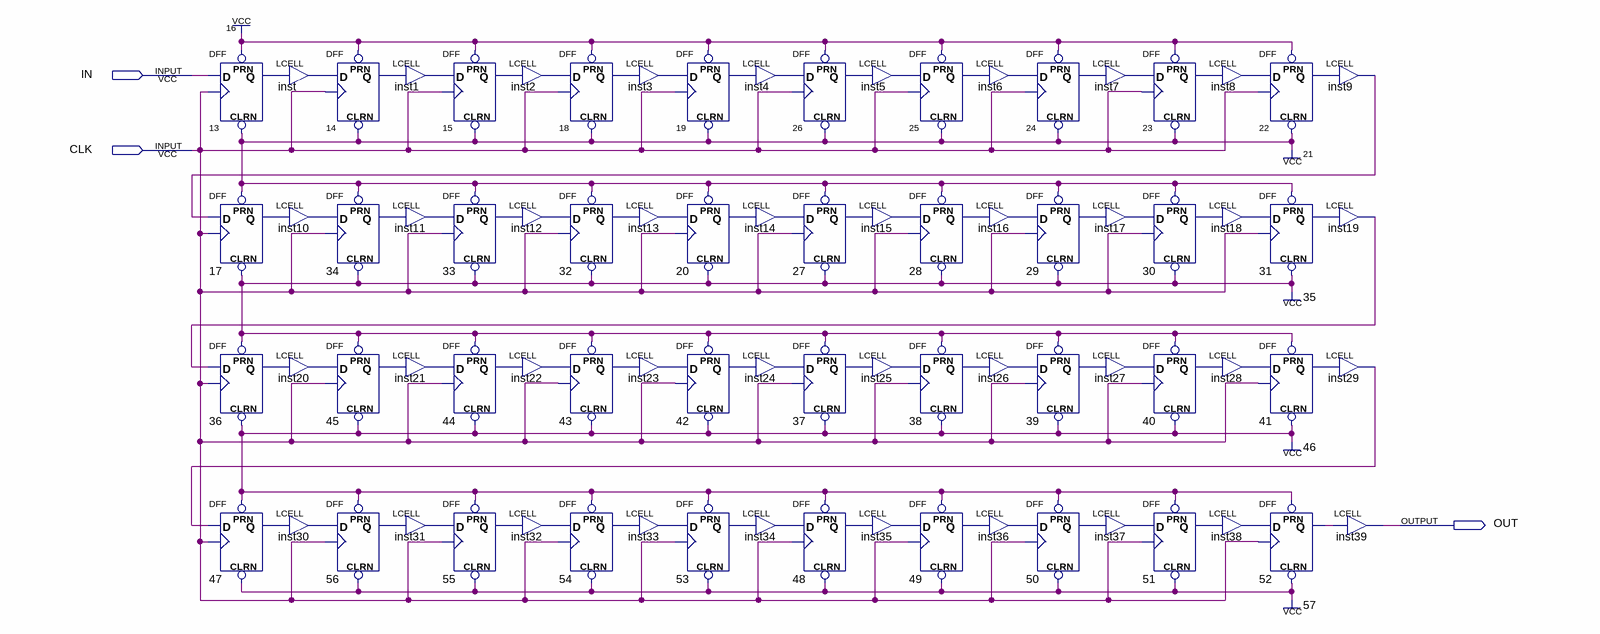
[diagram p0: schematic sheet]
// Quartus schematic sr40.bdf as structural Verilog: 80 symbols, 3 pins
module sr40 (
  input  IN,
  input  CLK,
  output OUT
);

  wire inst1_out, inst2_out, inst3_out, inst4_out, inst5_out, inst6_out, inst7_out, inst8_out, inst9_out,
       inst10_out, inst11_out, inst12_out, inst13_out, inst14_out, inst15_out, inst16_out, inst17_out,
       inst18_out, inst19_out, inst20_out, inst21_out, inst22_out, inst23_out, inst24_out, inst25_out,
       inst26_out, inst27_out, inst28_out, inst29_out, inst30_out, inst31_out, inst32_out, inst33_out,
       inst34_out, inst35_out, inst36_out, inst37_out, inst38_out, inst_out, n13_q, n14_q, n15_q, n17_q,
       n18_q, n19_q, n20_q, n22_q, n23_q, n24_q, n25_q, n26_q, n27_q, n28_q, n29_q, n30_q, n31_q, n32_q,
       n33_q, n34_q, n36_q, n37_q, n38_q, n39_q, n40_q, n41_q, n42_q, n43_q, n44_q, n45_q, n47_q, n48_q,
       n49_q, n50_q, n51_q, n52_q, n53_q, n54_q, n55_q, n56_q;

  DFF u_13 (.CLRN(1'b1), .CLK(CLK), .D(IN), .PRN(1'b1), .Q(n13_q));
  DFF u_17 (.CLRN(1'b1), .CLK(CLK), .D(inst9_out), .PRN(1'b1), .Q(n17_q));
  DFF u_36 (.CLRN(1'b1), .CLK(CLK), .D(inst19_out), .PRN(1'b1), .Q(n36_q));
  DFF u_47 (.CLRN(1'b1), .CLK(CLK), .D(inst29_out), .PRN(1'b1), .Q(n47_q));
  LCELL inst (.IN(n13_q), .OUT(inst_out));
  LCELL inst10 (.IN(n17_q), .OUT(inst10_out));
  LCELL inst20 (.IN(n36_q), .OUT(inst20_out));
  LCELL inst30 (.IN(n47_q), .OUT(inst30_out));
  DFF u_14 (.CLRN(1'b1), .CLK(CLK), .D(inst_out), .PRN(1'b1), .Q(n14_q));
  DFF u_34 (.CLRN(1'b1), .CLK(CLK), .D(inst10_out), .PRN(1'b1), .Q(n34_q));
  DFF u_45 (.CLRN(1'b1), .CLK(CLK), .D(inst20_out), .PRN(1'b1), .Q(n45_q));
  DFF u_56 (.CLRN(1'b1), .CLK(CLK), .D(inst30_out), .PRN(1'b1), .Q(n56_q));
  LCELL inst1 (.IN(n14_q), .OUT(inst1_out));
  LCELL inst11 (.IN(n34_q), .OUT(inst11_out));
  LCELL inst21 (.IN(n45_q), .OUT(inst21_out));
  LCELL inst31 (.IN(n56_q), .OUT(inst31_out));
  DFF u_15 (.CLRN(1'b1), .CLK(CLK), .D(inst1_out), .PRN(1'b1), .Q(n15_q));
  DFF u_33 (.CLRN(1'b1), .CLK(CLK), .D(inst11_out), .PRN(1'b1), .Q(n33_q));
  DFF u_44 (.CLRN(1'b1), .CLK(CLK), .D(inst21_out), .PRN(1'b1), .Q(n44_q));
  DFF u_55 (.CLRN(1'b1), .CLK(CLK), .D(inst31_out), .PRN(1'b1), .Q(n55_q));
  DFF u_18 (.CLRN(1'b1), .CLK(CLK), .D(inst2_out), .PRN(1'b1), .Q(n18_q));
  LCELL inst2 (.IN(n15_q), .OUT(inst2_out));
  DFF u_32 (.CLRN(1'b1), .CLK(CLK), .D(inst12_out), .PRN(1'b1), .Q(n32_q));
  LCELL inst12 (.IN(n33_q), .OUT(inst12_out));
  DFF u_43 (.CLRN(1'b1), .CLK(CLK), .D(inst22_out), .PRN(1'b1), .Q(n43_q));
  LCELL inst22 (.IN(n44_q), .OUT(inst22_out));
  DFF u_54 (.CLRN(1'b1), .CLK(CLK), .D(inst32_out), .PRN(1'b1), .Q(n54_q));
  LCELL inst32 (.IN(n55_q), .OUT(inst32_out));
  LCELL inst3 (.IN(n18_q), .OUT(inst3_out));
  LCELL inst13 (.IN(n32_q), .OUT(inst13_out));
  LCELL inst23 (.IN(n43_q), .OUT(inst23_out));
  LCELL inst33 (.IN(n54_q), .OUT(inst33_out));
  DFF u_19 (.CLRN(1'b1), .CLK(CLK), .D(inst3_out), .PRN(1'b1), .Q(n19_q));
  DFF u_20 (.CLRN(1'b1), .CLK(CLK), .D(inst13_out), .PRN(1'b1), .Q(n20_q));
  DFF u_42 (.CLRN(1'b1), .CLK(CLK), .D(inst23_out), .PRN(1'b1), .Q(n42_q));
  DFF u_53 (.CLRN(1'b1), .CLK(CLK), .D(inst33_out), .PRN(1'b1), .Q(n53_q));
  LCELL inst4 (.IN(n19_q), .OUT(inst4_out));
  LCELL inst14 (.IN(n20_q), .OUT(inst14_out));
  LCELL inst24 (.IN(n42_q), .OUT(inst24_out));
  LCELL inst34 (.IN(n53_q), .OUT(inst34_out));
  DFF u_26 (.CLRN(1'b1), .CLK(CLK), .D(inst4_out), .PRN(1'b1), .Q(n26_q));
  DFF u_27 (.CLRN(1'b1), .CLK(CLK), .D(inst14_out), .PRN(1'b1), .Q(n27_q));
  DFF u_37 (.CLRN(1'b1), .CLK(CLK), .D(inst24_out), .PRN(1'b1), .Q(n37_q));
  DFF u_48 (.CLRN(1'b1), .CLK(CLK), .D(inst34_out), .PRN(1'b1), .Q(n48_q));
  LCELL inst5 (.IN(n26_q), .OUT(inst5_out));
  LCELL inst15 (.IN(n27_q), .OUT(inst15_out));
  LCELL inst25 (.IN(n37_q), .OUT(inst25_out));
  LCELL inst35 (.IN(n48_q), .OUT(inst35_out));
  DFF u_25 (.CLRN(1'b1), .CLK(CLK), .D(inst5_out), .PRN(1'b1), .Q(n25_q));
  DFF u_28 (.CLRN(1'b1), .CLK(CLK), .D(inst15_out), .PRN(1'b1), .Q(n28_q));
  DFF u_38 (.CLRN(1'b1), .CLK(CLK), .D(inst25_out), .PRN(1'b1), .Q(n38_q));
  DFF u_49 (.CLRN(1'b1), .CLK(CLK), .D(inst35_out), .PRN(1'b1), .Q(n49_q));
  DFF u_24 (.CLRN(1'b1), .CLK(CLK), .D(inst6_out), .PRN(1'b1), .Q(n24_q));
  LCELL inst6 (.IN(n25_q), .OUT(inst6_out));
  DFF u_29 (.CLRN(1'b1), .CLK(CLK), .D(inst16_out), .PRN(1'b1), .Q(n29_q));
  LCELL inst16 (.IN(n28_q), .OUT(inst16_out));
  DFF u_39 (.CLRN(1'b1), .CLK(CLK), .D(inst26_out), .PRN(1'b1), .Q(n39_q));
  LCELL inst26 (.IN(n38_q), .OUT(inst26_out));
  DFF u_50 (.CLRN(1'b1), .CLK(CLK), .D(inst36_out), .PRN(1'b1), .Q(n50_q));
  LCELL inst36 (.IN(n49_q), .OUT(inst36_out));
  LCELL inst7 (.IN(n24_q), .OUT(inst7_out));
  LCELL inst17 (.IN(n29_q), .OUT(inst17_out));
  LCELL inst27 (.IN(n39_q), .OUT(inst27_out));
  LCELL inst37 (.IN(n50_q), .OUT(inst37_out));
  DFF u_23 (.CLRN(1'b1), .CLK(CLK), .D(inst7_out), .PRN(1'b1), .Q(n23_q));
  DFF u_30 (.CLRN(1'b1), .CLK(CLK), .D(inst17_out), .PRN(1'b1), .Q(n30_q));
  DFF u_40 (.CLRN(1'b1), .CLK(CLK), .D(inst27_out), .PRN(1'b1), .Q(n40_q));
  DFF u_51 (.CLRN(1'b1), .CLK(CLK), .D(inst37_out), .PRN(1'b1), .Q(n51_q));
  LCELL inst8 (.IN(n23_q), .OUT(inst8_out));
  LCELL inst18 (.IN(n30_q), .OUT(inst18_out));
  LCELL inst28 (.IN(n40_q), .OUT(inst28_out));
  LCELL inst38 (.IN(n51_q), .OUT(inst38_out));
  DFF u_22 (.CLRN(1'b1), .CLK(CLK), .D(inst8_out), .PRN(1'b1), .Q(n22_q));
  DFF u_31 (.CLRN(1'b1), .CLK(CLK), .D(inst18_out), .PRN(1'b1), .Q(n31_q));
  DFF u_41 (.CLRN(1'b1), .CLK(CLK), .D(inst28_out), .PRN(1'b1), .Q(n41_q));
  DFF u_52 (.CLRN(1'b1), .CLK(CLK), .D(inst38_out), .PRN(1'b1), .Q(n52_q));
  LCELL inst9 (.IN(n22_q), .OUT(inst9_out));
  LCELL inst19 (.IN(n31_q), .OUT(inst19_out));
  LCELL inst29 (.IN(n41_q), .OUT(inst29_out));
  LCELL inst39 (.IN(n52_q), .OUT(OUT));
endmodule
